# Altium schematic sheet unonhietdodoam.SchDoc
size A
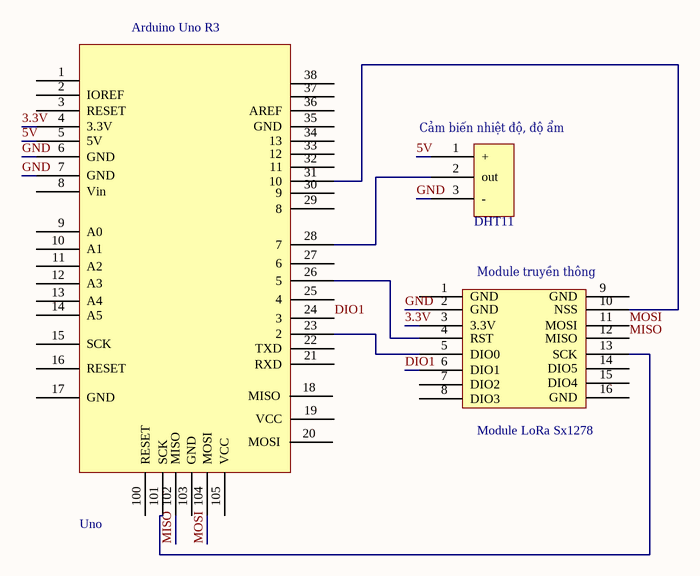
[diagram p0: unonhietdodoam.SchDoc]

## Parts
Arduino_Uno_R3  Uno  [PCBComponent_1]
Cảm_biến_nhiệt_độ,_độ_ẩm  DHT11  [PCBDHT11]
Module_truyền_thông  Module LoRa Sx1278  [PCBLoRa]

## Nets
3.3V: Arduino_Uno_R3.4(3.3V) Module_truyền_thông.3(3.3V)
5V: Arduino_Uno_R3.5(5V) Cảm_biến_nhiệt_độ,_độ_ẩm.1(+)
DIO1: Arduino_Uno_R3.24(3) Module_truyền_thông.6(DIO1)
GND: Arduino_Uno_R3.6(GND) Arduino_Uno_R3.7(GND) Cảm_biến_nhiệt_độ,_độ_ẩm.3(-) Module_truyền_thông.2(GND)
MISO: Arduino_Uno_R3.102(MISO) Module_truyền_thông.12(MISO)
MOSI: Arduino_Uno_R3.104(MOSI) Module_truyền_thông.11(MOSI)
NetArduino_Uno_R3_23: Arduino_Uno_R3.23(2) Module_truyền_thông.5(DIO0)
NetArduino_Uno_R3_26: Arduino_Uno_R3.26(5) Module_truyền_thông.4(RST)
NetArduino_Uno_R3_28: Arduino_Uno_R3.28(7) Cảm_biến_nhiệt_độ,_độ_ẩm.2(out)
NetArduino_Uno_R3_31: Arduino_Uno_R3.31(10) Module_truyền_thông.10(NSS)
NetArduino_Uno_R3_101: Arduino_Uno_R3.101(SCK) Module_truyền_thông.13(SCK)

Not connected (* = marked no-connect by the designer): Arduino_Uno_R3 1 2(IOREF) 3(RESET) 8(Vin) 9(A0) 10(A1) 11(A2) 12(A3) 13(A4) 14(A5) 15(SCK) 16(RESET) 17(GND) 18(MISO) 19(VCC) 20(MOSI) 21(RXD) 22(TXD) 25(4) 27(6) 29(8) 30(9) 32(11) 33(12) 34(13) 35(GND) 36(AREF) 37 38 100(RESET) 103(GND) 105(VCC); Module_truyền_thông 1(GND) 7(DIO2) 8(DIO3) 9(GND) 14(DIO5) 15(DIO4) 16(GND)

## Library data of the parts
Cảm_biến_nhiệt_độ,_độ_ẩm Module_truyền_thông = Component_1